# Altium schematic sheet RESISTORS_OLD.SchDoc
size A4; SheetNumber: 4; SheetTotal: 4
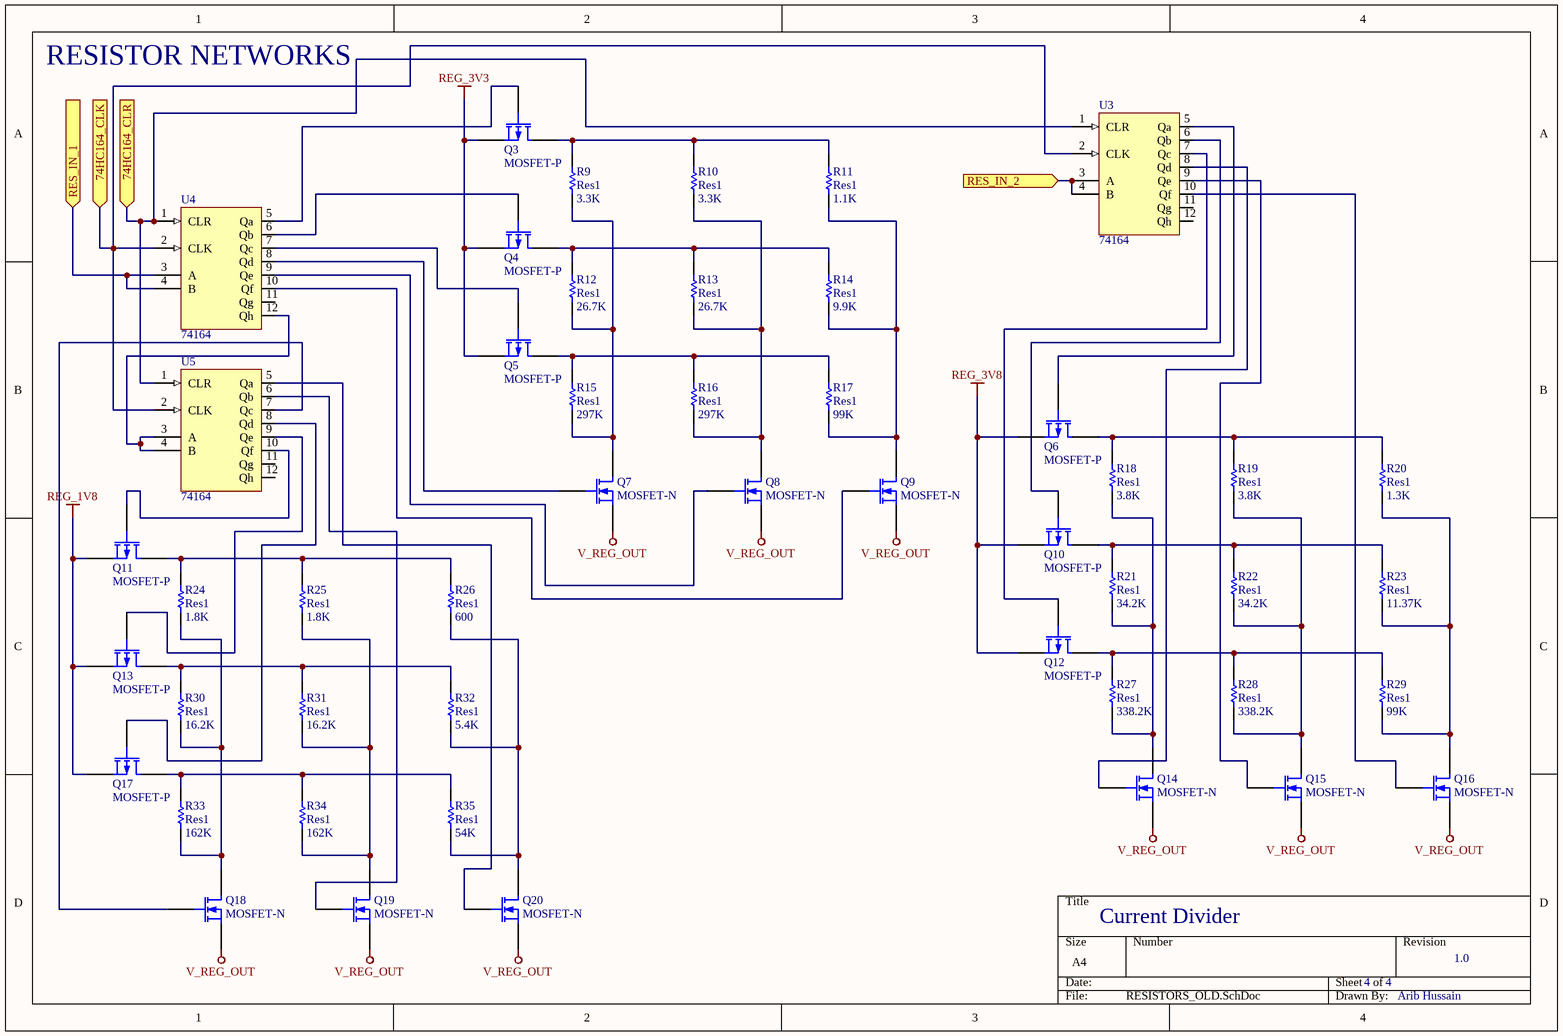
[diagram p0: RESISTORS_OLD.SchDoc]

## Parts
Q3  MOSFET-P  [E3]
Q4  MOSFET-P  [E3]
Q5  MOSFET-P  [E3]
Q6  MOSFET-P  [E3]
Q7  MOSFET-N  [E3]
Q8  MOSFET-N  [E3]
Q9  MOSFET-N  [E3]
Q10  MOSFET-P  [E3]
Q11  MOSFET-P  [E3]
Q12  MOSFET-P  [E3]
Q13  MOSFET-P  [E3]
Q14  MOSFET-N  [E3]
Q15  MOSFET-N  [E3]
Q16  MOSFET-N  [E3]
Q17  MOSFET-P  [E3]
Q18  MOSFET-N  [E3]
Q19  MOSFET-N  [E3]
Q20  MOSFET-N  [E3]
R9  Res1  value 3.3K  [AXIAL-0.3]
R10  Res1  value 3.3K  [AXIAL-0.3]
R11  Res1  value 1.1K  [AXIAL-0.3]
R12  Res1  value 26.7K  [AXIAL-0.3]
R13  Res1  value 26.7K  [AXIAL-0.3]
R14  Res1  value 9.9K  [AXIAL-0.3]
R15  Res1  value 297K  [AXIAL-0.3]
R16  Res1  value 297K  [AXIAL-0.3]
R17  Res1  value 99K  [AXIAL-0.3]
R18  Res1  value 3.8K  [AXIAL-0.3]
R19  Res1  value 3.8K  [AXIAL-0.3]
R20  Res1  value 1.3K  [AXIAL-0.3]
R21  Res1  value 34.2K  [AXIAL-0.3]
R22  Res1  value 34.2K  [AXIAL-0.3]
R23  Res1  value 11.37K  [AXIAL-0.3]
R24  Res1  value 1.8K  [AXIAL-0.3]
R25  Res1  value 1.8K  [AXIAL-0.3]
R26  Res1  value 600  [AXIAL-0.3]
R27  Res1  value 338.2K  [AXIAL-0.3]
R28  Res1  value 338.2K  [AXIAL-0.3]
R29  Res1  value 99K  [AXIAL-0.3]
R30  Res1  value 16.2K  [AXIAL-0.3]
R31  Res1  value 16.2K  [AXIAL-0.3]
R32  Res1  value 5.4K  [AXIAL-0.3]
R33  Res1  value 162K  [AXIAL-0.3]
R34  Res1  value 162K  [AXIAL-0.3]
R35  Res1  value 54K  [AXIAL-0.3]
U3  74164
U4  74164
U5  74164

## Ports
74HC164_CLK (in), 74HC164_CLR (in), RES_IN_1 (in), RES_IN_2 (in)

## Nets
REG_1V8: Q11.3(S) Q13.3(S) Q17.3(S)
REG_3V3: Q3.3(S) Q4.3(S) Q5.3(S)
REG_3V8: Q6.3(S) Q10.3(S) Q12.3(S)
V_REG_OUT: Q7.3(S) Q8.3(S) Q9.3(S) Q14.3(S) Q15.3(S) Q16.3(S) Q18.3(S) Q19.3(S) Q20.3(S)
74HC164_CLK: U3.2(CLK) U4.2(CLK) U5.2(CLK) ; port 74HC164_CLK
74HC164_CLR: U3.1(CLR) U4.1(CLR) U5.1(CLR) ; port 74HC164_CLR
RES_IN_1: U4.3(A) U4.4(B) ; port RES_IN_1
RES_IN_2: U3.3(A) U3.4(B) ; port RES_IN_2
NetQ3_1: Q3.1(D) R9.2 R10.2 R11.2
NetQ3_2: Q3.2(G) U4.5(Qa)
NetQ4_1: Q4.1(D) R12.2 R13.2 R14.2
NetQ4_2: Q4.2(G) U4.6(Qb)
NetQ5_1: Q5.1(D) R15.2 R16.2 R17.2
NetQ5_2: Q5.2(G) U4.7(Qc)
NetQ6_1: Q6.1(D) R18.2 R19.2 R20.2
NetQ6_2: Q6.2(G) U3.5(Qa)
NetQ7_1: Q7.1(D) R9.1 R12.1 R15.1
NetQ7_2: Q7.2(G) U4.8(Qd)
NetQ8_1: Q8.1(D) R10.1 R13.1 R16.1
NetQ8_2: Q8.2(G) U4.9(Qe)
NetQ9_1: Q9.1(D) R11.1 R14.1 R17.1
NetQ9_2: Q9.2(G) U4.10(Qf)
NetQ10_1: Q10.1(D) R21.2 R22.2 R23.2
NetQ10_2: Q10.2(G) U3.6(Qb)
NetQ11_1: Q11.1(D) R24.2 R25.2 R26.2
NetQ11_2: Q11.2(G) U5.10(Qf)
NetQ12_1: Q12.1(D) R27.2 R28.2 R29.2
NetQ12_2: Q12.2(G) U3.7(Qc)
NetQ13_1: Q13.1(D) R30.2 R31.2 R32.2
NetQ13_2: Q13.2(G) U5.9(Qe)
NetQ14_1: Q14.1(D) R18.1 R21.1 R27.1
NetQ14_2: Q14.2(G) U3.8(Qd)
NetQ15_1: Q15.1(D) R19.1 R22.1 R28.1
NetQ15_2: Q15.2(G) U3.9(Qe)
NetQ16_1: Q16.1(D) R20.1 R23.1 R29.1
NetQ16_2: Q16.2(G) U3.10(Qf)
NetQ17_1: Q17.1(D) R33.2 R34.2 R35.2
NetQ17_2: Q17.2(G) U5.8(Qd)
NetQ18_1: Q18.1(D) R24.1 R30.1 R33.1
NetQ18_2: Q18.2(G) U5.7(Qc)
NetQ19_1: Q19.1(D) R25.1 R31.1 R34.1
NetQ19_2: Q19.2(G) U5.6(Qb)
NetQ20_1: Q20.1(D) R26.1 R32.1 R35.1
NetQ20_2: Q20.2(G) U5.5(Qa)
NetU4_12: U4.12(Qh) U5.3(A) U5.4(B)

Not connected (* = marked no-connect by the designer): U3 11(Qg) 12(Qh); U4 11(Qg); U5 11(Qg) 12(Qh)

## Notes on the sheet
- RESISTOR NETWORKS
- Current Divider
- 4
- 1.0
- Arib Hussain

## Library data of the parts
Q3-Q6 Q10-Q13 Q17 = MOSFET-P: P-Channel MOSFET; Published: 8-Jun-2000; LatestRevisionDate: 17-Jul-2002; LatestRevisionNote: Re-released for DXP Platform.; PackageVersion: 1995/1996; PackageReference: E3; Publisher: Altium Limited; PackageDescription: TO, Flat Index; 3 In-Line, Axial Leads; Body Dia. 4.6mm; Lead Dia. 0.5 mm (max)
Q7-Q9 Q14-Q16 Q18-Q20 = MOSFET-N: N-Channel MOSFET; Published: 8-Jun-2000; LatestRevisionDate: 17-Jul-2002; LatestRevisionNote: Re-released for DXP Platform.; PackageVersion: 1995/1996; PackageReference: E3; Publisher: Altium Limited; PackageDescription: TO, Flat Index; 3 In-Line, Axial Leads; Body Dia. 4.6mm; Lead Dia. 0.5 mm (max)
R9-R35 = Res1: Resistor; Published: 8-Jun-2000; LatestRevisionDate: 17-Jul-2002; LatestRevisionNote: Re-released for DXP Platform.; PackageReference: AXIAL-0.3; Publisher: Altium Limited; PackageDescription: Axial Device, Thru-Hole; 2 Leads; 0.3 in Pin Spacing
U3-U5 = 74HC164: 8-Bit Shift Register